# Altium schematic sheet TvsTester.SchDoc: Test
size A4; DrawnBy: Łukasz Przeniosło; Organization: PRZENIOSLO; Address1: Electronics; Address2: &; Address3: Software; DocumentNumber: 1; Revision: 1.0; SheetNumber: 1; SheetTotal: 2
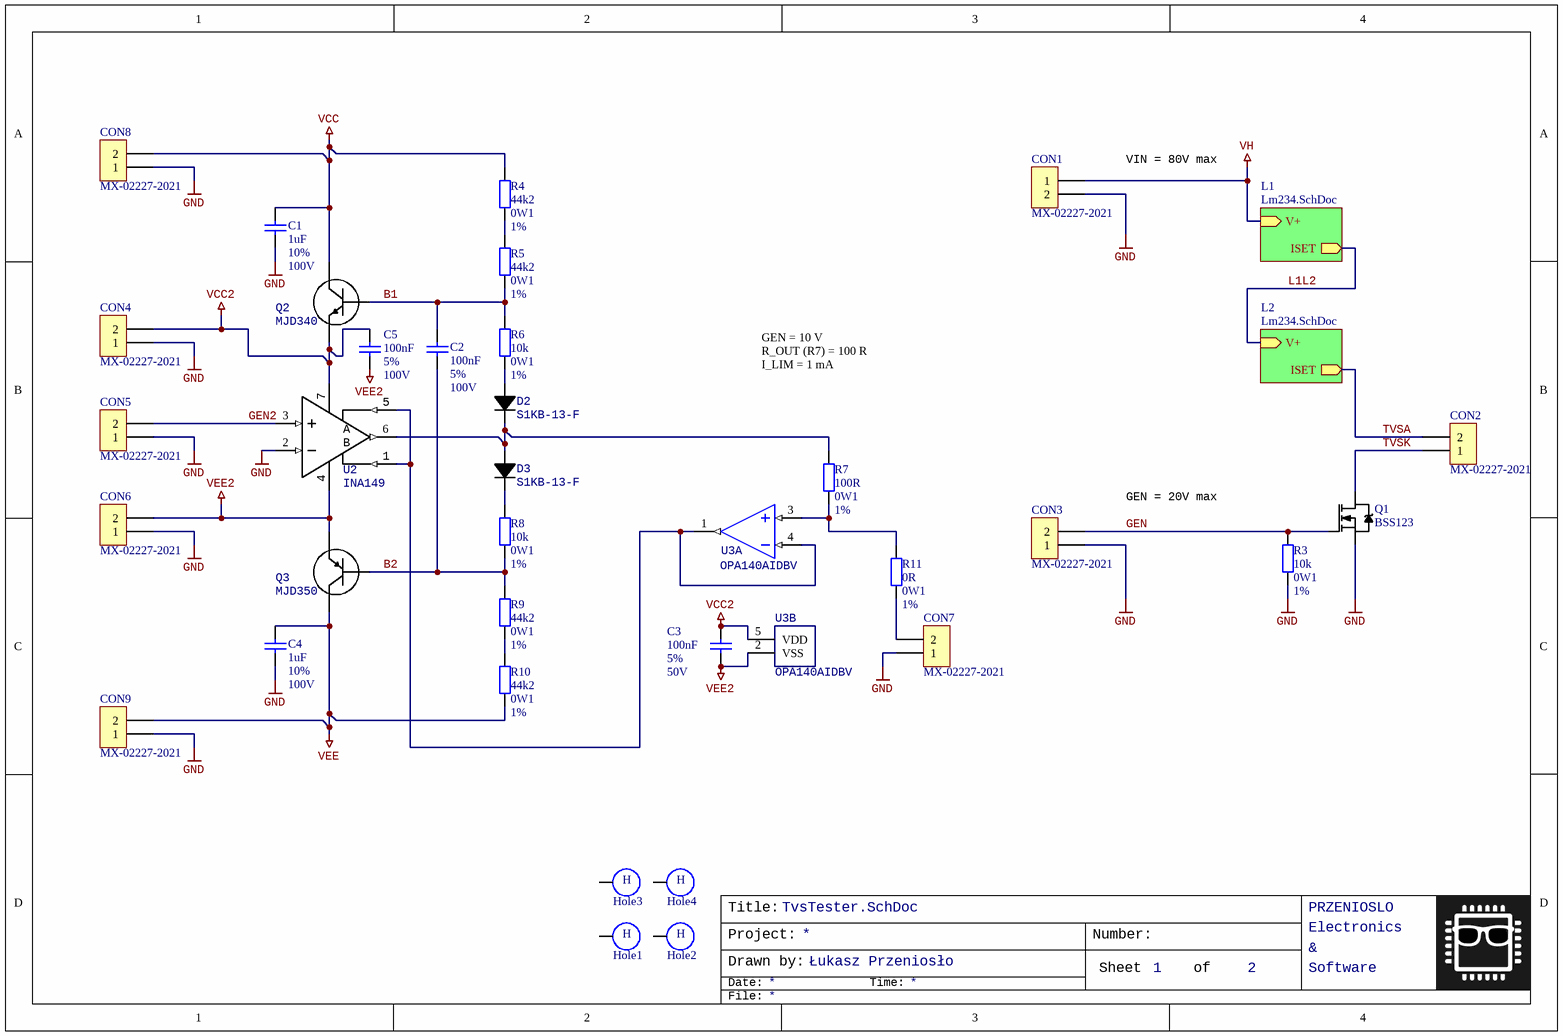
[diagram p0: TvsTester.SchDoc]

## Parts
C1  1uF  Tolerance: 10%  Voltage: 100V  [CAPC3225N]
C2  100nF  Tolerance: 5%  Voltage: 100V  [CAPC3216N]
C3  100nF  Tolerance: 5%  Voltage: 50V  [CAPC1608N]
C4  1uF  Tolerance: 10%  Voltage: 100V  [CAPC3225N]
C5  100nF  Tolerance: 5%  Voltage: 100V  [CAPC3216N]
CON1  MX-02227-2021  [MX-02227-2021]
CON2  MX-02227-2021  [MX-02227-2021]
CON3  MX-02227-2021  [MX-02227-2021]
CON4  MX-02227-2021  [MX-02227-2021]
CON5  MX-02227-2021  [MX-02227-2021]
CON6  MX-02227-2021  [MX-02227-2021]
CON7  MX-02227-2021  [MX-02227-2021]
CON8  MX-02227-2021  [MX-02227-2021]
CON9  MX-02227-2021  [MX-02227-2021]
D2  S1KB-13-F  [SMB]
D3  S1KB-13-F  [SMB]
Hole1  Hole  [HOLE-6/3.2]  (value not drawn)
Hole2  Hole  [HOLE-6/3.2]  (value not drawn)
Hole3  Hole  [HOLE-6/3.2]  (value not drawn)
Hole4  Hole  [HOLE-6/3.2]  (value not drawn)
Q1  BSS123  [sot23-3l]
Q2  MJD340  [DPAK_TO252 _1SIDE]
Q3  MJD350  [DPAK_TO252 _1SIDE]
R3  10k  Power: 0W1  Tolerance: 1%  [RESC1608N]
R4  44k2  Power: 0W1  Tolerance: 1%  [RESC1608N]
R5  44k2  Power: 0W1  Tolerance: 1%  [RESC1608N]
R6  10k  Power: 0W1  Tolerance: 1%  [RESC1608N]
R7  100R  Power: 0W1  Tolerance: 1%  [RESC3216N]
R8  10k  Power: 0W1  Tolerance: 1%  [RESC1608N]
R9  44k2  Power: 0W1  Tolerance: 1%  [RESC1608N]
R10  44k2  Power: 0W1  Tolerance: 1%  [RESC1608N]
R11  0R  Power: 0W1  Tolerance: 1%  [RESC3216N]
U2  INA149  [SO-8_L]
U3  OPA140AIDBV  [SOT23-5_N]  (parts A,B of 2)

## Sub-sheets
L1 = Lm234.SchDoc: V+ (in), ISET (out)
L2 = Lm234.SchDoc: V+ (in), ISET (out)

## Nets
GND: C1.1 C4.1 CON1.2 CON3.1 CON4.1 CON5.1 CON6.1 CON7.1 CON8.1 CON9.1 Q1.2(S) R3.1 U2.2(-IN)
VCC: C1.2 CON8.2 Q2.2(C) R4.2
VCC2: C3.2 C5.2 CON4.2 Q2.3(E) U2.7(V+) U3.5(VDD)
VEE: C4.2 CON9.2 Q3.2(C) R10.1
VEE2: C3.1 C5.1 CON6.2 Q3.3(E) U2.4(VS-) U3.2(VSS)
VH: CON1.1 ; sheet L1/V+
B1: C2.2 Q2.1(B) R5.1 R6.2
B2: C2.1 Q3.1(B) R8.1 R9.2
GEN: CON3.2 Q1.1(G) R3.2
GEN2: CON5.2 U2.3(+IN)
L1L2: sheet L1/ISET, sheet L2/V+
TVSA: CON2.2 ; sheet L2/ISET
TVSK: CON2.1 Q1.3(D)
NetCON7_2: CON7.2 R11.1
NetD2_1: D2.1(A) R6.1
NetD2_2: D2.2(K) D3.1(A) R7.2 U2.6(VOUT)
NetD3_2: D3.2(K) R8.2
NetR4_1: R4.1 R5.2
NetR7_1: R7.1 R11.2 U3.3(+IN)
NetR9_1: R9.1 R10.2
NetU2_1: U2.1(REFB) U2.5(REFA) U3.1(OUT) U3.4(-IN)

Not connected (* = marked no-connect by the designer): Hole1 1; Hole2 1; Hole3 1; Hole4 1; U2 8(NC)

## Notes on the sheet
- VIN = 80V max
- GEN = 10 V
  R_OUT (R7) = 100 R
  I_LIM = 1 mA
- GEN = 20V max
- Title:
- Date:
- Drawn by:
- Project:
- Time:
- Number:
- Sheet
- of
- File:
- (in symbol HOLE_) H
- (in symbol INA149) A; B

## Library data of the parts
C1-C5 = Capacitor
  C1 C4: Value: 1uF
  C2 C3 C5: Value: 100nF
CON1-CON9 = MX-02227-2021: Pith 2.54mm, 2-pin; ComponentLink1Description: Manufacturer Link; ComponentLink2Description: Datasheet; Distributor: tme.pl; tme.pl: MX-6410-03A
D2 D3 = S1KB-13-F: Universal diode; manid: S1KB-13-F
Hole1-Hole4 = HOLE_
Q2 = MJD340: High voltage NPN power transistor; manid: MJD340
Q3 = MJD350: High voltage PNP power transistor; manid: MJD350
R3-R11 = Resistor
  R3 R6 R8: Value: 10k
  R4 R5 R9 R10: Value: 44k2
  R7: Value: 100R
  R11: Value: 0R
U2 = INA149: High Common-Mode Voltage Difference Amplifier; manid: INA149
U3 = OPA140: 1 MHz, Low-Power Op Amp; manid: OPA140AIDBV
Q1 = BSS123: manid: BSS123